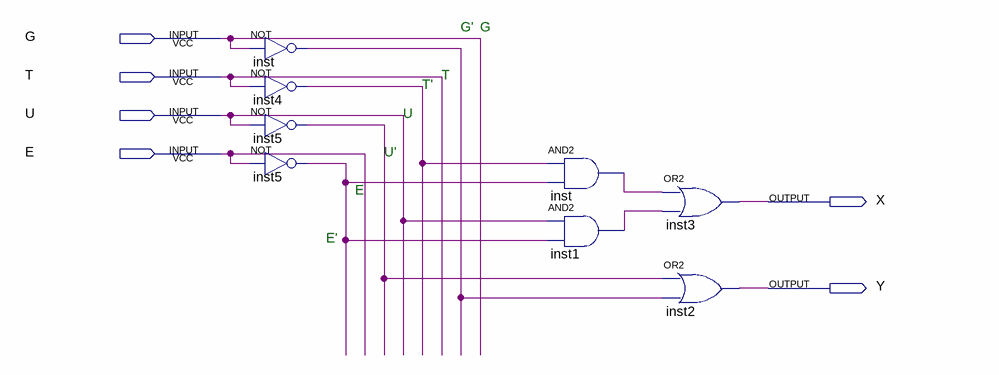
[diagram p0: schematic sheet]
// Quartus schematic lab1_g8_p3.bdf as structural Verilog: 8 symbols, 6 pins
module lab1_g8_p3 (
  input  G,
  input  T,
  input  U,
  input  E,
  output X,
  output Y
);

  wire inst1_out, inst4_out, inst5_out, inst5_out_2, inst_out, inst_out_2;

  not inst (inst_out_2, G);
  not inst4 (inst4_out, T);
  not inst5 (inst5_out, U);
  not inst5_dup2 (inst5_out_2, E);
  and inst_dup2 (inst_out, inst4_out, inst5_out_2);
  and inst1 (inst1_out, U, inst5_out_2);
  or inst3 (X, inst_out, inst1_out);
  or inst2 (Y, inst5_out, inst_out_2);

  // Notes on the sheet:
  //   G'
  //   G
  //   T
  //   T'
  //   U
  //   U'
  //   E
  //   E'
endmodule
